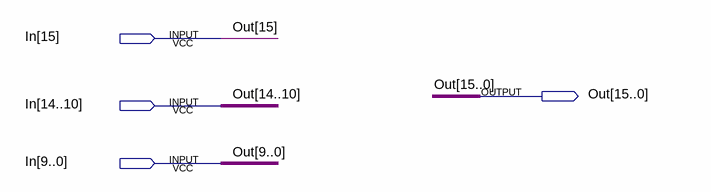
[diagram p0: schematic sheet]
// Quartus schematic dataout_FP16.bdf as structural Verilog: 0 symbols, 4 pins
module dataout_FP16 (
  input  [15:0] In,
  output [15:0] Out
);


  assign Out = In;
endmodule
